# EAGLE board Arch GPRS v2.0 (EAGLE 6.4)
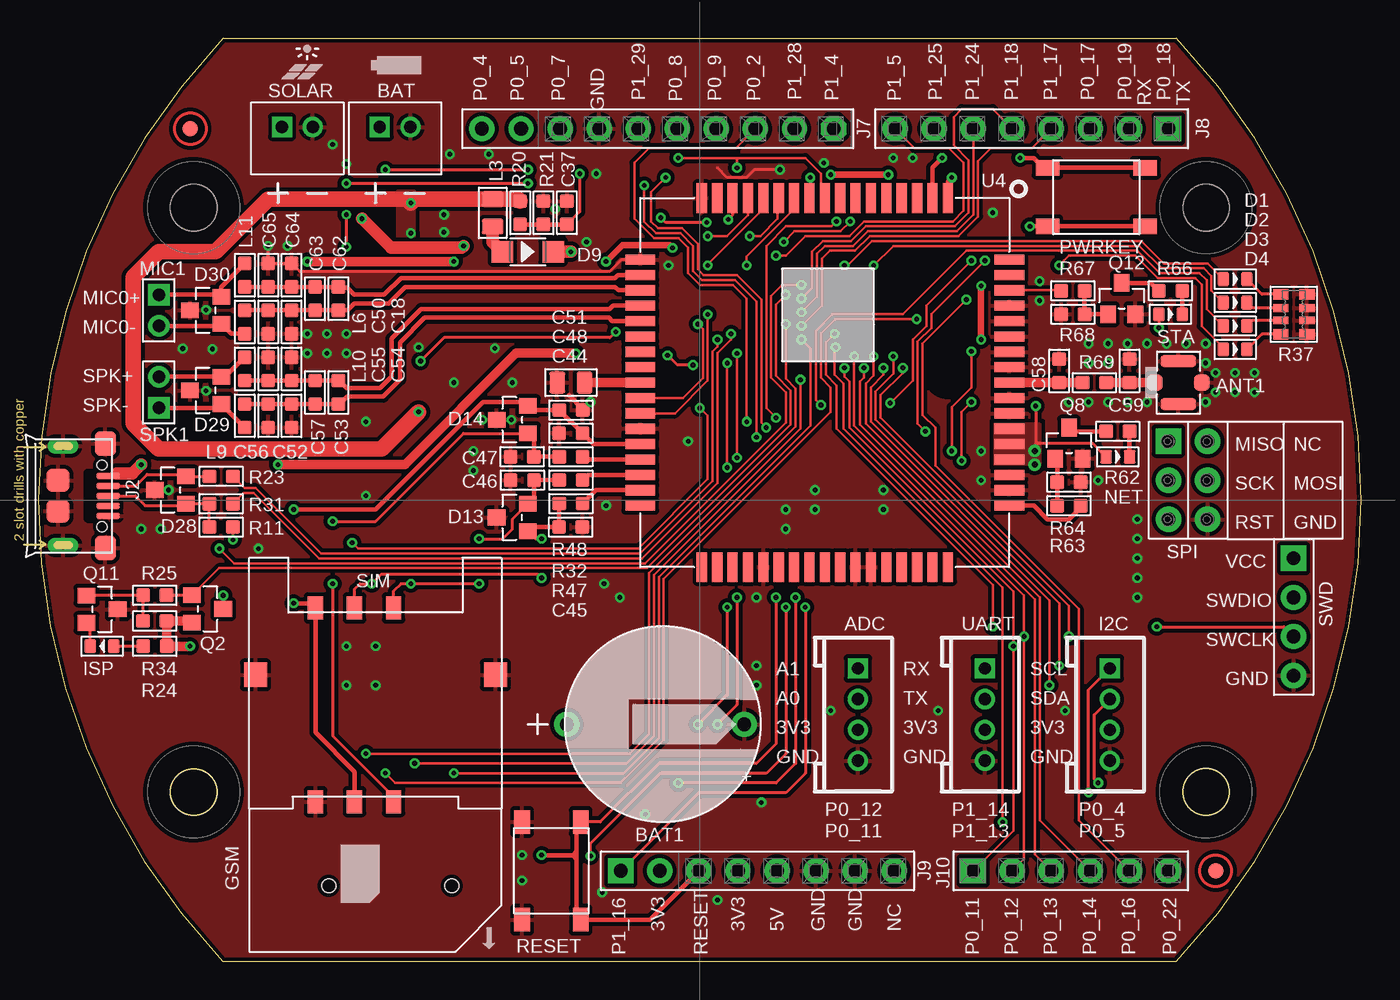
[diagram p2: board, top side]
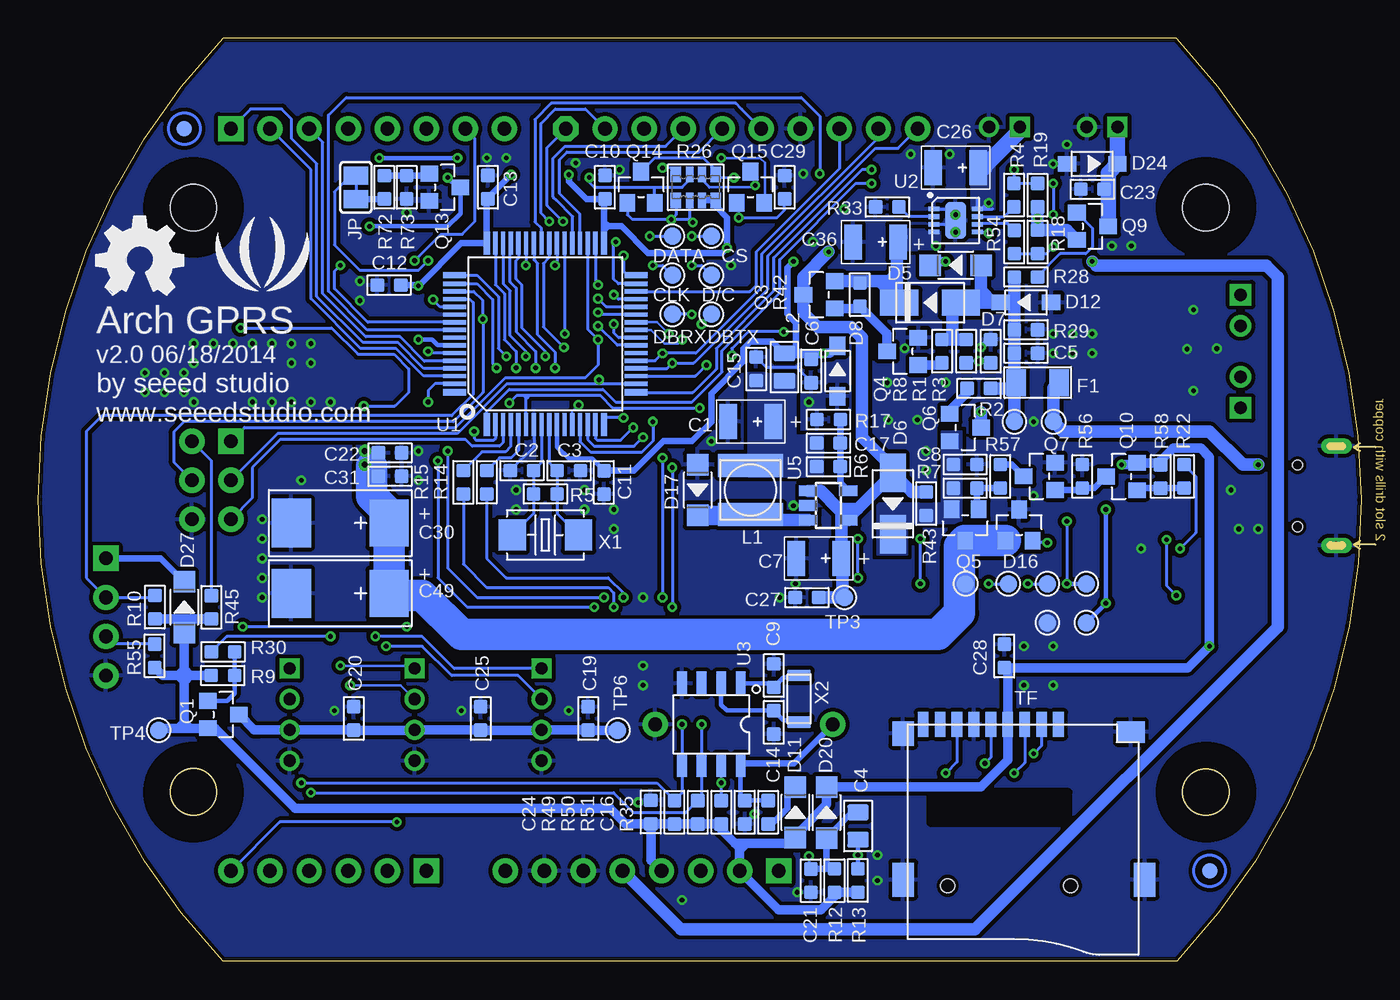
[diagram p3: board, bottom side, seen from below]

Size 86 x 60 mm. Coordinates in mm from the lower left corner, seen from the top.
Outline: 12.01,60 74,60 arc-87 74,0 11.99,0
Outline: 12.01,60 arc87 11.99,0
Outline: circle at 75.91,11 radius 1.5
Outline: circle at 10.09,11 radius 1.5
Copper layers (1*16): Top 0.035mm / dielectric 1.5mm / Bottom 0.035mm
Design rules "SeeedStudio_2layer_DRU_no_angle_20140221 *": minimum track width 6mil, minimum drill 12mil, track to track 6mil, track to pad 6mil, pad to pad 6mil, via to via 6mil, smd to smd 0mil, copper to edge 10mil, drill to drill 10mil, minimum pad ring 10mil, minimum via ring 6mil, stop-mask expansion 2mil, vias tented up to drill 100mil, thermal gap 10mil
Net classes: 0 default: width 0.102 mm, drill 0.203 mm, clearance 0.102 mm
Holes 3 mm at 10.09,49 75.91,49 75.91,11 10.09,11
tRestrict: area 72.9,46 to 78.9,52; area 72.9,8 to 78.9,14; area 7.1,8 to 13.1,14; area 7.1,46 to 13.1,52; area 62.7,42.1 to 63.6,42.2; area 62.7,41.1 to 63.6,41.2; area 62.7,40 to 63.6,40.2; area 62.7,39.1 to 63.6,39.3; area 62.7,36.1 to 63.6,36.2; area 62.7,31.1 to 63.6,31.3; area 73.5,36.9 to 74.9,38.4
bRestrict: area 7.1,46 to 13.1,52; area 72.9,46 to 78.9,52; area 7.1,8 to 13.1,14; area 72.9,8 to 78.9,14

## Footprints (pad centres in the part's own frame; a part is rotated, then mirrored left to right if it is on the bottom)
4P-2.0 = drill 0.8 pad 1.27 square: 1 -3,0 | drill 0.8 pad 1.27: 2 -1,0; 3 1,0; 4 3,0
4P-U-FL = smd 1.016 x 1.016: D -1.524,0; GND3 1.524,0 | smd 2.286 x 0.762: GND1 0,1.397; GND2 0,-1.397
JST-2.0 = drill 0.8 pad 1.3 square: 1 -1,0.75 | drill 0.8 pad 1.3: 2 1,0.75
2P-D12.55X2.22H = drill 0.889 pad 1.651: + -6.25,0; - 5.3,0
AVX-B = smd 1.143 x 2.286: + -1.46,0; - 1.46,0
C0603 = smd 0.889 x 0.889: 1 -0.762,0; 2 0.762,0
C0805 = smd 1.016 x 1.397: 1 -0.889,0; 2 0.889,0
AVX-D = smd 2.54 x 3.048: + -3.175,0 | smd 2.54 x 3.175: - 3.175,0
TP_4545 = smd 1.143 x 1.143: T 0,0
LED-0603 = smd 0.762 x 0.889: + -0.762,0; - 0.762,0
SOD123 = smd 1.397 x 1.397: + -1.651,0; - 1.651,0
SMA = smd 2.5 x 1.7: 1 2,0; 2 -2,0
SOD123-2.7X1.6 = smd 1.2 x 1.02: 1 -1.635,0; 2 1.635,0
SOT23 = smd 1.016 x 1.143: 1 -0.889,-1.016; 2 0.889,-1.016; 3 0,1.016
F1206 = smd 1.27 x 1.778: 1 -1.397,0; 2 1.397,0
MICRO-USB = smd 0.381 x 1.524: 1 -1.3,-0.25; 2 -0.65,-0.25; 3 0,-0.25; 4 0.65,-0.25; 5 1.3,-0.25 | smd 1.6 x 1.397: S1 -3.4,-0.427; S6 3.4,-0.427 | drill 0.508 pad 1.016 long: S2 -3.226,-3.175; S5 3.226,-3.175 | smd 1.5 x 1.5: S3 -1,-3.5; S4 1,-3.5 | hole 0.635: -2,-0.65; 2,-0.65
10P-2.54 = drill 0.889 pad 1.651 octagon: 1 0,11.43 | drill 0.889 pad 1.651: 2 0,8.89; 3 0,6.35; 4 0,3.81; 5 0,1.27; 6 0,-1.27; 7 0,-3.81; 8 0,-6.35; 9 0,-8.89; 10 0,-11.43
8P-2.54 = drill 0.889 pad 1.651 square: 1 0,8.89 | drill 0.889 pad 1.651: 2 0,6.35; 3 0,3.81; 4 0,1.27; 5 0,-1.27; 6 0,-3.81; 7 0,-6.35; 8 0,-8.89
6P-2.54-65/35MIL = drill 0.889 pad 1.651 square: 1 0,6.35 | drill 0.889 pad 1.651: 2 0,3.81; 3 0,1.27; 4 0,-1.27; 5 0,-3.81; 6 0,-6.35
2P-SMD-3.3X2 = smd 1.168 x 1.6: 1 -0.762,0; 2 0.762,0
L0420 = smd 1.5 x 4.2: 1 -1.6,0; 2 1.6,0
L0805 = smd 1.016 x 1.397: 1 -0.889,0; 2 0.889,0
L0603 = smd 0.889 x 0.889: 1 -0.762,0; 2 0.762,0
2P-2.0 = drill 0.813 pad 1.397 square: 1 -1.016,0 | drill 0.813 pad 1.397: 2 1.016,0
ROUND-MARK-1.0 = smd 1.016 x 1.016: P$1 0,0
BTN_S = smd 1.524 x 1.016: 0A -3.175,1.905; 0B 3.175,1.905; 1A -3.175,-1.905; 1B 3.175,-1.905
R0603 = smd 0.889 x 0.889: 1 -0.762,0; 2 0.762,0
1206-8-3.3X2.4 = smd 0.7 x 1: 1 -1.3,-0.85; 4 1.3,-0.85; 5 1.3,0.85; 8 -1.3,0.85 | smd 0.5 x 1: 2 -0.4,-0.85; 3 0.4,-0.85; 6 0.4,0.85; 7 -0.4,0.85
6P-1.8 = smd 1.5 x 1: 1 -6.3,-3.9; 2 -6.3,-1.36; 3 -6.3,1.18; 4 6.3,1.18; 5 6.3,-1.36; 6 6.3,-3.9 | smd 1.6 x 1.5: P1 -1.95,-7.8; P2 -1.95,7.8
2X3P-2.54 = drill 0.889 pad 1.651 square: 1 -1.27,2.54 | drill 0.889 pad 1.651: 2 -1.27,0; 3 -1.27,-2.54; 4 1.27,-2.54; 5 1.27,0; 6 1.27,2.54
4P-65/35MIL = drill 0.889 pad 1.651 square: 1 0,3.81 | drill 0.889 pad 1.651: 2 0,1.27; 3 0,-1.27; 4 0,-3.81
9P-SMD-W/-RING = smd 1.6 x 0.7: 1 0,2.25; 2 0,1.15; 3 0,0.05; 4 0,-1.05; 5 0,-2.15; 6 0,-3.25; 7 0,-4.35; 8 0,-5.45; 9 0,-6.55 | smd 1.6 x 1.4: G1 0.6,-7.85 | smd 2.2 x 1.4: G2 10.1,-7.85; G3 10.1,7.85 | smd 1.4 x 1.8: G4 0.5,6.95 | hole 0.9: 10.5,-4.95; 10.5,3.05
LQFP64 = smd 1.5 x 0.4: 1 -5.9,3.81; 16 -5.9,-3.81; 33 5.9,-3.81; 48 5.9,3.81 | smd 1.5 x 0.28: 2 -5.9,3.25; 3 -5.9,2.75; 4 -5.9,2.25; 5 -5.9,1.75; 6 -5.9,1.25; 7 -5.9,0.75; 8 -5.9,0.25; 9 -5.9,-0.25; 10 -5.9,-0.75; 11 -5.9,-1.25; 12 -5.9,-1.75; 13 -5.9,-2.25; 14 -5.9,-2.75; 15 -5.9,-3.25; 34 5.9,-3.25; 35 5.9,-2.75; 36 5.9,-2.25; 37 5.9,-1.75; 38 5.9,-1.25; 39 5.9,-0.75; 40 5.9,-0.25; 41 5.9,0.25; 42 5.9,0.75; 43 5.9,1.25; 44 5.9,1.75; 45 5.9,2.25; 46 5.9,2.75; 47 5.9,3.25 | smd 0.4 x 1.5: 17 -3.81,-5.9; 32 3.81,-5.9; 49 3.81,5.9; 64 -3.81,5.9 | smd 0.28 x 1.5: 18 -3.25,-5.9; 19 -2.75,-5.9; 20 -2.25,-5.9; 21 -1.75,-5.9; 22 -1.25,-5.9; 23 -0.75,-5.9; 24 -0.25,-5.9; 25 0.25,-5.9; 26 0.75,-5.9; 27 1.25,-5.9; 28 1.75,-5.9; 29 2.25,-5.9; 30 2.75,-5.9; 31 3.25,-5.9; 50 3.25,5.9; 51 2.75,5.9; 52 2.25,5.9; 53 1.75,5.9; 54 1.25,5.9; 55 0.75,5.9; 56 0.25,5.9; 57 -0.25,5.9; 58 -0.75,5.9; 59 -1.25,5.9; 60 -1.75,5.9; 61 -2.25,5.9; 62 -2.75,5.9; 63 -3.25,5.9
DFN8 = smd 0.3 x 0.727: 1 -0.75,-1.413; 2 -0.25,-1.413; 3 0.25,-1.413; 4 0.75,-1.413; 5 0.75,1.413; 6 0.25,1.413; 7 -0.25,1.413; 8 -0.75,1.413 | smd 2.413 x 1.397: HEAT 0,0
SOP8 = smd 0.635 x 1.524: 1 -1.905,-2.667; 2 -0.635,-2.667; 3 0.635,-2.667; 4 1.905,-2.667; 5 1.905,2.667; 6 0.635,2.667; 7 -0.635,2.667; 8 -1.905,2.667
SIM900 = smd 1.93 x 0.66: 1 -12,8; 2 -12,7; 3 -12,6; 4 -12,5; 5 -12,4; 6 -12,3; 7 -12,2; 8 -12,1; 9 -12,0; 10 -12,-1; 11 -12,-2; 12 -12,-3; 13 -12,-4; 14 -12,-5; 15 -12,-6; 16 -12,-7; 17 -12,-8; 35 12,-8; 36 12,-7; 37 12,-6; 38 12,-5; 39 12,-4; 40 12,-3; 41 12,-2; 42 12,-1; 43 12,0; 44 12,1; 45 12,2; 46 12,3; 47 12,4; 48 12,5; 49 12,6; 50 12,7; 51 12,8 | smd 0.66 x 1.93: 18 -8,-12; 19 -7,-12; 20 -6,-12; 21 -5,-12; 22 -4,-12; 23 -3,-12; 24 -2,-12; 25 -1,-12; 26 0,-12; 27 1,-12; 28 2,-12; 29 3,-12; 30 4,-12; 31 5,-12; 32 6,-12; 33 7,-12; 34 8,-12; 52 8,12; 53 7,12; 54 6,12; 55 5,12; 56 4,12; 57 3,12; 58 2,12; 59 1,12; 60 0,12; 61 -1,12; 62 -2,12; 63 -3,12; 64 -4,12; 65 -5,12; 66 -6,12; 67 -7,12; 68 -8,12
SOT23-5 = smd 0.69 x 1.2: 1 -0.95,-1.3; 2 0,-1.3; 3 0.95,-1.3; 4 0.95,1.3; 5 -0.95,1.3
2P-SMD-5X3.2 = smd 1.778 x 2.032: 1 -2.159,0; 2 2.159,0
2P-SMD-3.2X1.5 = smd 0.762 x 1.524: 1 -1.524,0; 2 1.524,0

## Placement (x,y rotation side)
ADC  DIP Grove  [4P-2.0]  53.29,16.03 270 top
ANT1  [4P-U-FL]  74.12,37.62 0 top
BAT  DIP JST  [JST-2.0]  23.19,53.5 0 top
BAT1  CR1220(LC)  [2P-D12.55X2.22H]  40.6,15.4 0 top
C1  10V100uF  [AVX-B]  39.69,35.08 180 bottom
C2  12pF  [C0603]  54.56,31.9 0 bottom
C3  12pF  [C0603]  51.51,31.9 180 bottom
C4  10uF  [C0805]  32.71,8.79 90 bottom
C5  100nF  [C0603]  21.79,39.53 180 bottom
C6  39pF  [C0603]  35.76,38.38 90 bottom
C7  10V100uF  [AVX-B]  35.26,26.19 180 bottom
C8  100nF  [C0603]  25.74,32.29 180 bottom
C9  DNP  [C0603]  38.19,18.57 270 bottom
C10  100nF  [C0603]  49.16,50.33 270 bottom
C11  100nF  [C0603]  49.23,31.13 90 bottom
C12  100nF  [C0603]  63.2,43.96 0 bottom
C13  100nF  [C0603]  56.77,50.33 270 bottom
C14  DNP  [C0603]  38.19,15.53 90 bottom
C15  100nF  [C0603]  39.33,38.52 270 bottom
C16  100nF  [C0603]  40.07,9.68 270 bottom
C17  39pF  [C0603]  34.63,33.68 180 bottom
C18  DNP  [C0603]  16.46,41.56 270 top
C19  100nF  [C0603]  50.26,15.78 270 bottom
C20  100nF  [C0603]  65.5,15.78 270 bottom
C21  100nF  [C0603]  35.78,5.23 90 bottom
C22  100nF  [C0603]  63.14,33.05 180 bottom
C23  100nF  [C0603]  17.46,50.19 0 bottom
C24  100nF  [C0603]  46.19,9.69 270 bottom
C25  100nF  [C0603]  57.24,15.78 270 bottom
C26  10V100uF  [AVX-B]  26.36,51.59 180 bottom
C27  100nF  [C0603]  36.03,23.65 0 bottom
C28  100nF  [C0603]  23.19,19.84 90 bottom
C29  100nF  [C0603]  37.48,50.32 90 bottom
C30  470uF 6.3V  [AVX-D]  66.38,28.49 180 bottom
C31  39pF  [C0603]  63.14,31.53 180 bottom
C36  10V100uF  [AVX-B]  31.57,46.77 180 bottom
C37  100nF  [C0603]  34.36,48.66 270 top
C44  39pF  [C0603]  34.62,34.33 0 top
C45  39pF  [C0603]  34.61,28.22 180 top
C46  39pF  [C0603]  31.46,31.27 0 top
C47  39pF  [C0603]  31.45,32.8 0 top
C48  39pF  [C0603]  34.63,35.83 180 top
C49  470uF 6.3V  [AVX-D]  66.38,23.91 180 bottom
C50  DNP  [C0603]  14.94,41.56 270 top
C51  10uF  [C0805]  34.62,37.62 0 top
C52  DNP  [C0603]  16.46,35.46 90 top
C53  DNP  [C0603]  19.51,36.99 90 top
C54  DNP  [C0603]  16.46,38.51 90 top
C55  DNP  [C0603]  14.94,38.51 90 top
C56  DNP  [C0603]  14.94,35.46 90 top
C57  DNP  [C0603]  17.99,36.99 90 top
C58  DNP  [C0603]  66.37,38.38 270 top
C59  DNP  [C0603]  70.95,38.38 270 top
C62  DNP  [C0603]  19.51,43.08 270 top
C63  DNP  [C0603]  17.99,43.08 90 top
C64  DNP  [C0603]  16.46,44.61 270 top
C65  DNP  [C0603]  14.94,44.61 270 top
CLK  [TP_4545]  44.78,44.61 180 bottom
CS  [TP_4545]  42.24,47.15 180 bottom
D1  Yellow  [LED-0603]  77.81,44.35 0 top
D2  Blue  [LED-0603]  77.81,42.83 0 top
D3  Green  [LED-0603]  77.81,41.3 0 top
D4  Red  [LED-0603]  77.81,39.78 0 top
D5  B5819W  [SOD123]  26.36,45.25 180 bottom
D6  1N5819  [SMA]  30.45,29.75 270 bottom
D7  1N5819  [SMA]  28.02,42.81 180 bottom
D8  CESD5V0D1  [SOD123-2.7X1.6]  34.04,38.38 90 bottom
D9  B5819W  [SOD123]  31.82,46.12 0 top
D11  B5819W  [SOD123]  36.78,9.68 90 bottom
D12  CESD5V0D1  [SOD123-2.7X1.6]  21.79,42.83 180 bottom
D13  DNP  [SOT23]  30.8,28.85 90 top
D14  DNP  [SOT23]  30.81,35.21 90 top
D16  CESD3V3AP  [SOT23]  22.24,28.35 0 bottom
D17  B5819W  [SOD123]  43.13,30.64 270 bottom
D20  B5819W  [SOD123]  34.75,9.67 90 bottom
D24  CESD5V0D1  [SOD123-2.7X1.6]  17.48,51.85 0 bottom
D27  B5819W  [SOD123]  76.51,23.02 90 bottom
D28  CESD3V3AP  [SOT23]  8.58,30.64 90 top
D29  DNP  [SOT23]  10.87,37.11 90 top
D30  DNP  [SOT23]  10.87,42.32 90 top
D/C  [TP_4545]  42.24,44.61 180 bottom
DATA  [TP_4545]  44.78,47.15 180 bottom
DBRX  DBURX  [TP_4545]  44.78,42.07 0 bottom
DBTX  [TP_4545]  42.24,42.07 0 bottom
F1  PPTC_1000mA  [F1206]  21.02,37.63 180 bottom
I2C  DIP Grove  [4P-2.0]  69.67,16.03 270 top
ISP  Blue  [LED-0603]  4.13,20.48 180 top
J2  [MICRO-USB]  4.78,30.26 270 top
J7  1X10P-2.54-8.5  [10P-2.54]  40.27,54.13 270 top
J8  1X8P-2.54-8.5  [8P-2.54]  64.59,54.13 270 top
J9  1X8P-2.54-8.5  [8P-2.54]  46.76,5.87 90 top
J10  1X6P-2.54-8.5  [6P-2.54-65/35MIL]  67.13,5.87 90 top
JP  [2P-SMD-3.3X2]  65.36,50.32 270 bottom
L1  4.7uH  [L0420]  39.7,30.64 90 bottom
L2  470R/2A  [L0805]  37.49,38.63 90 bottom
L3  470R/2A  [L0805]  29.54,48.66 270 top
L6  DNP  [L0603]  13.41,41.56 270 top
L9  DNP  [L0603]  13.41,35.46 270 top
L10  DNP  [L0603]  13.41,38.51 90 top
L11  DNP  [L0603]  13.41,44.61 90 top
MIC1  DNP  [2P-2.0]  7.83,42.32 270 top
NET  green  [LED-0603]  70.18,32.8 0 top
P1  [ROUND-MARK-1.0]  9.87,54.13 0 top
P2  [ROUND-MARK-1.0]  76.55,5.87 0 top
P3  [ROUND-MARK-1.0]  9.84,5.87 0 bottom
P6  [ROUND-MARK-1.0]  76.52,54.13 0 bottom
PWRKEY  DNP  [BTN_S]  68.79,49.69 180 top
Q1  CJ2305  [SOT23]  73.98,16.03 270 bottom
Q2  CJ2305  [SOT23]  11,22.9 270 top
Q3  CJ2305  [SOT23]  35.24,43.34 90 bottom
Q4  2N7002  [SOT23]  29.8,39.65 90 bottom
Q5  CJ2305  [SOT23]  25.74,28.36 180 bottom
Q6  CJ2305  [SOT23]  25.73,34.7 270 bottom
Q7  2N7002  [SOT23]  20.92,31.53 90 bottom
Q8  9013  [SOT23]  67.01,33.68 0 top
Q9  CJ2305  [SOT23]  17.46,47.78 270 bottom
Q10  CJ2305  [SOT23]  15.57,31.52 90 bottom
Q11  CJ2305  [SOT23]  4.14,22.88 270 top
Q12  9013  [SOT23]  70.44,43.08 0 top
Q13  9013  [SOT23]  59.58,50.32 270 bottom
Q14  2N7002  [SOT23]  46.82,50.32 0 bottom
Q15  2N7002  [SOT23]  39.7,50.32 0 bottom
R1  1k  [R0603]  25.67,39.66 270 bottom
R2  100R  [R0603]  24.84,37.24 0 bottom
R3  100k  [R0603]  24.08,39.66 90 bottom
R4  1k  [R0603]  22.57,49.81 270 bottom
R5  DNP  [R0603]  53.04,30.38 180 bottom
R6  68k_1%  [R0603]  34.63,32.16 180 bottom
R7  100k  [R0603]  25.74,30.76 0 bottom
R8  100R  [R0603]  27.25,39.66 90 bottom
R9  100k  [R0603]  74.01,18.57 180 bottom
R10  100k  [R0603]  78.43,23.02 90 bottom
R11  1k  [R0603]  11.87,28.22 0 top
R12  10M  [R0603]  34.24,5.24 90 bottom
R13  1k  [R0603]  32.72,5.24 90 bottom
R14  1k  [R0603]  56.85,31.14 90 bottom
R15  1k  [R0603]  58.37,31.13 90 bottom
R17  15k_1%  [R0603]  34.62,35.22 180 bottom
R18  30k  [R0603]  21.03,46.77 90 bottom
R19  30k  [R0603]  21.03,49.81 270 bottom
R20  1M_1%  [R0603]  31.32,48.66 90 top
R21  1M_1%  [R0603]  32.84,48.66 270 top
R22  100R  [R0603]  11.51,31.53 90 bottom
R23  22R  [R0603]  11.88,31.52 0 top
R24  1k  [R0603]  7.57,20.48 180 top
R25  1k  [R0603]  7.57,23.79 180 top
R26  4.7k  [1206-8-3.3X2.4]  43.26,50.32 180 bottom
R28  100R  [R0603]  21.79,44.48 180 bottom
R29  10k  [R0603]  21.79,41.06 180 bottom
R30  100R  [R0603]  74,20.1 180 bottom
R31  22R  [R0603]  11.88,29.74 0 top
R32  22R  [R0603]  34.62,31.28 0 top
R33  3.9k  [R0603]  30.8,49.05 0 bottom
R34  100k  [R0603]  7.56,22.12 180 top
R35  4.7k  [R0603]  38.55,9.68 90 bottom
R37  1k  [1206-8-3.3X2.4]  81.63,42.07 270 top
R42  1M_1%  [R0603]  32.59,43.34 270 bottom
R43  DNP  [R0603]  28.28,29.75 90 bottom
R45  DNP  [R0603]  74.76,23.01 270 bottom
R47  22R  [R0603]  34.62,29.76 0 top
R48  22R  [R0603]  34.62,32.8 0 top
R49  4.7k  [R0603]  44.65,9.68 270 bottom
R50  4.7k  [R0603]  43.12,9.68 270 bottom
R51  4.7k  [R0603]  41.6,9.68 270 bottom
R54  1k  [R0603]  22.55,46.77 90 bottom
R55  100k  [R0603]  78.44,19.85 90 bottom
R56  100k  [R0603]  18.12,31.53 270 bottom
R57  22R  [R0603]  23.46,31.53 270 bottom
R58  100k  [R0603]  13.03,31.52 90 bottom
R62  470R  [R0603]  70.18,34.45 180 top
R63  4.7k  [R0603]  67.01,29.62 180 top
R64  47k  [R0603]  67.01,31.14 0 top
R66  470R  [R0603]  73.61,43.59 180 top
R67  4.7k  [R0603]  67.26,43.59 0 top
R68  47k  [R0603]  67.26,42.07 180 top
R69  0R  [R0603]  68.66,37.62 180 top
R72  4.7k  [R0603]  63.52,50.32 90 bottom
R73  47k  [R0603]  62.06,50.32 270 bottom
RESET  BTN_S  [BTN_S]  33.35,5.87 270 top
SIM  ST-SIM-004B  [6P-1.8]  21.91,16.67 270 top
SOLAR  DIP JST  [JST-2.0]  16.84,53.5 0 top
SPI  2X3P-2.54-2.54-11.6/3.0  [2X3P-2.54]  74.75,31.27 0 top
SPK1  DNP  [2P-2.0]  7.83,36.99 90 top
STA  red  [LED-0603]  73.61,42.07 0 top
SWD  DNP  [4P-65/35MIL]  81.61,22.38 0 top
TF  [9P-SMD-W/-RING]  21.92,15.4 270 bottom
TP1  [TP_4545]  20,35.08 270 bottom
TP2  [TP_4545]  22.54,35.08 270 bottom
TP3  [TP_4545]  33.59,23.65 270 bottom
TP4  [TP_4545]  78.18,15.02 270 bottom
TP5  [TP_4545]  20.4,24.54 0 bottom
TP6  [TP_4545]  48.34,15.02 270 bottom
TP7  [TP_4545]  25.72,24.54 270 bottom
TP8  [TP_4545]  22.94,24.54 0 bottom
TP9  [TP_4545]  17.86,24.54 0 bottom
TP10  [TP_4545]  17.86,22 0 bottom
TP11  [TP_4545]  20.4,22 0 bottom
U1  LPC11U37FBD64/501  [LQFP64]  53.04,40.8 90 bottom
U2  CN3065  [DFN8]  26.36,48.16 270 bottom
U3  DS1337S  [SOP8]  42.24,15.4 180 bottom
U4  SIM900  [SIM900]  51.13,37.62 270 top
U5  TD6810-ADJ  [SOT23-5]  34.63,29.63 270 bottom
U$55  [LOGO_SILK]  71.45,45.24 0 bottom
U$56  [OSHW_FILLX200_NOTEXT]  82.25,43.34 0 bottom
UART  DIP Grove  [4P-2.0]  61.54,16.03 270 top
X1  12MHz  [2P-SMD-5X3.2]  53.04,27.71 180 bottom
X2  050037001 ABS07-32.768KHZ-7-T  [2P-SMD-3.2X1.5]  36.54,17.05 90 bottom

## Tracks (layer width: path | path; a pad name or v marks a point on that pad's centre or on a via)
DISP_CLK  (via drill 0.3 pad 0.64)
  Top 0.152: U4.11 49.13,48.83 49.07,48.83 46.05,45.81 v46.05,45.24
  Bottom 0.203: v46.05,45.24 45.42,45.24 CLK.T
DISP_CS  (via drill 0.3 pad 0.64)
  Top 0.152: U4.14 46.13,48.5 44.78,47.15 v43.51,47.15
  Bottom 0.203: v43.51,47.15 CS.T
DISP_D/C  (via drill 0.3 pad 0.64)
  Top 0.152: U4.13 47.07,49.56 47.07,48.86 43.51,45.3 v43.51,45.24
  Bottom 0.203: v43.51,45.24 42.88,45.24 D/C.T
DISP_DATA  (via drill 0.3 pad 0.64)
  Top 0.152: U4.12 48.13,48.85 48.07,48.85 48.07,48.27 46.94,47.15 v46.24,47.15 46.56,47.15
  Bottom 0.203: v46.24,47.15 DATA.T
EG10_SIM_CLK  (via drill 0.3 pad 0.64)
  Top 0.203: v28.65,27.46 30.18,27.46 30.81,28.1 30.81,28.74 D13.2 | v28.65,24.54 v24.21,24.54 23.57,24.54 23.09,24.06 SIM.3
  Top 0.305: R32.1 33.85,31.27 C46.2 32.23,30.15 D13.2
  Bottom 0.203: v28.65,24.54 v28.65,27.46 | v24.21,24.54 TP8.T
EG10_SIM_IO  (via drill 0.3 pad 0.64)
  Top 0.152: SIM.4 23.09,10.54 | D14.1 30.69,34.32
  Top 0.203: D14.1 27.64,34.32 21.92,28.6 v19.13,28.6 | v19.13,24.54 19.13,14.63 23.09,10.67 SIM.4
  Top 0.305: R48.1 C47.2 32.22,33.94 D14.1
  Bottom 0.203: v19.13,28.6 v19.13,24.54
  Bottom 0.305: TP9.T v19.13,24.54
EG10_SIM_RST  (via drill 0.3 pad 0.64)
  Top 0.203: v32.72,27.46 32.32,27.46 D13.1 | 32.66,24.98 v32.72,24.92 32.46,25.18 22.3,25.18 v21.67,24.54 20.91,24.54 20.55,24.19 SIM.2 | 33.86,28.37 33.86,28.24 C45.2
  Top 0.305: C45.2 32.08,28.22 D13.1 | R47.1 33.86,28.37
  Bottom 0.203: v32.72,24.92 v32.72,27.46 | v21.67,24.54 TP5.T
GND  (via drill 0.3 pad 0.64)
  Top 0.203: v48.21,51.46 46.56,51.46 46.05,50.96 44.78,50.96 44.15,51.59 | v14.94,46.51 C65.1 C64.1 16.97,44.86 37.16,44.86 37.92,45.62 U4.18
  Top 0.254: C56.1 14.94,34.64
  Top 0.305: C48.1 35.39,35.9 34.5,36.8 | U4.18 38.43,45.62
  Bottom 0.203: U1.7 53.79,33.44 C2.1 | U2.1 26.51,48.91 | U2.3 26.5,47.91 26.36,48.05 U2.HEAT | C15.1 38.69,38.64 36.72,38.64 35.76,37.68 C6.1
  Bottom 0.305: C16.2 40.07,8.93 v39.45,9.55
  Bottom 0.406: v24.72,39.91 24.2,40.43 R3.2 24.17,40.43 24.72,39.88 v24.72,39.91 | v24.72,39.91 24.74,39.88
  other vias: 20.02,51.85 17.48,39.53 17.48,40.8 20.02,40.8 20.02,39.53 21.29,30.26 27,37.62 29.67,39.84 21.29,35.08 18.75,39.53 18.75,40.8 20.02,20.48 21.92,20.48 21.92,17.94 20.02,17.94 8.46,30.64 6.68,28.1 7.95,28.1 36.66,4.47 31.45,5.24 31.45,6.89 44.15,3.97 47.01,10.32 65.1,42.96 61.29,31.27 61.29,33.18 54.94,30.64 54.94,29.37 50.5,30.64 50.5,29.37 48.59,29.37 48.59,28.1 46.69,23.65 46.69,19.21 46.69,17.94 62.06,48.67 56.85,52.23 55.58,52.23 40.97,45.24 36.27,51.21 26.37,48.54 26.37,47.4 28.27,31.91 28.27,33.18 28.84,35.21 30.75,35.21 30.81,37.62 35.89,36.35 42.24,33.81 37.8,23.65 36.78,24.54 36.91,29.62 51.07,51.91 68.28,38.89 69.55,38.89 69.55,40.16 68.28,40.16 68.28,36.35 69.55,36.35 70.82,36.35 72.09,36.35 67.01,36.35 70.82,40.16 72.09,40.16 73.36,40.16 74.63,40.16 75.9,40.16 76.53,38.26 76.53,36.99 75.9,36.35 75.9,38.89 77.8,36.99 77.8,38.26 79.07,36.99 79.07,38.26 68.91,31.27 71.45,28.73 71.45,27.46 71.45,26.19 71.45,24.92 71.45,23.65 65.1,44.23 14.3,26.83 10.9,42.35 10.9,37.09 9.38,39.83 11.31,39.81 16.21,46.51 58.5,16.29 66.75,16.29 51.51,16.29 26.75,52.48 29.29,52.48 33.61,48.92 35.64,46.77 19.13,53.12
  pour Top (isolate 0.254, rank 6): -0.94,60.48 86.69,60.48 86.69,-0.48 -0.94,-0.48
  pour Bottom (isolate 0.254, rank 6): -0.94,60.48 86.69,60.48 86.69,-0.48 -0.94,-0.48
LDBG_RX  (via drill 0.3 pad 0.64)
  Top 0.152: U4.28 41.38,35.62 43.51,37.75 v43.51,42.07
  Bottom 0.203: v43.51,42.07 DBRX.T
LDBG_TX  (via drill 0.3 pad 0.64)
  Top 0.152: U4.27 41.9,36.62 43.2,37.92 43.2,41.11 v42.88,41.43
  Bottom 0.203: v42.88,41.43 DBTX.T
LRXD  (via drill 0.3 pad 0.64)
  Top 0.152: v50.18,50.96 50.18,50.26 50.24,50.19 50.24,49.73 U4.10
  Bottom 0.203: R26.3 43.66,50.81 44.15,50.32 45.93,50.32 | v50.18,50.96 50.18,50.64 49.86,50.32 45.93,50.32 | Q14.2 45.93,50.32
LTXD  (via drill 0.3 pad 0.64)
  Top 0.152: v41.61,52.23 45.29,52.23 | v45.42,51.59 45.42,52.1 | 45.42,52.1 45.42,52.23 | 45.42,52.23 45.55,52.23 | 45.55,52.23 49.86,52.23 50.88,51.21 50.88,49.88 U4.9 | 45.29,52.23 45.42,52.1 | 45.42,52.1 45.55,52.23 | 45.42,52.23 45.29,52.23
  Bottom 0.152: v41.61,52.23 39.07,52.23 38.75,51.91 38.75,49.37 Q15.2 38.43,49.69 | 44.53,51.46 44.56,51.43 R26.4 44.98,51.59 | v45.42,51.59 44.98,51.59 | 44.98,51.59 44.66,51.59
  Bottom 0.203: 44.73,51.34 R26.4
N$1
  Bottom 0.406: SWD.1 78.04,26.19 D27.-
N$2
  Top 0.203: R37.4 79.56,40.77 D4.-
N$3  (via drill 0.3 pad 0.64)
  Top 0.203: v12.02,23.78 Q2.3 | v12.65,27.4 12.65,28.21 R11.2
  Bottom 0.203: v12.65,27.4 12.65,24.41 v12.02,23.78
N$4
  Bottom 0.406: R57.2 R7.2 24.98,29.62 24.85,29.49 Q5.1
N$5
  Bottom 0.203: U2.2 29.41,48.41 R33.2
N$6
  Bottom 0.406: R35.1 38.31,8.91 37.29,9.94 37.29,11.08 37.04,11.33 D11.-
N$7  (via drill 0.3 pad 0.64)
  Top 0.203: v48.59,23.02 48.59,13.49 47.32,12.22 40.47,12.22 35.89,7.65 v35.89,6.82
  Bottom 0.203: R15.1 58.37,25.81 56.85,24.29 48.94,24.29 48.59,23.94 v48.59,23.02 | 36.02,6.24 C21.2 35.89,6.11 v35.89,6.82
  Bottom 0.406: C21.2 34.75,5.99 | 34.75,5.99 R12.2 | C4.2 33.09,9.68 D20.+ 34.75,5.99
N$8
  Bottom 0.61: 32.47,42.46 R42.2 | Q3.1 32.71,42.45 R42.2 | Q4.3 30.82,40.8 R42.2
N$9
  pour Bottom (isolate 0.254, no thermals): 25.99,34.45 27.26,34.45 27.26,29.75 31.45,29.75 31.45,26.45 29.54,26.45 29.54,28.48 25.99,28.48
N$10
  Top 0.813: L3.2 29.54,46.75 D9.+
N$11
  Bottom 0.406: JP.2 R72.1
N$12
  Bottom 0.305: R30.1 R9.1 73.25,17.41 73.74,16.92 Q1.1
N$13
  Bottom 0.305: U3.2 41.61,16.67 41.23,16.29 C14.2 37.55,15.65 36.53,15.65 36.54,15.64 X2.1
N$14
  Bottom 0.305: U3.1 38.45,18.06 C9.2 37.55,18.44 36.53,18.44 36.54,18.45 X2.2
N$15
  Top 0.203: R34.2 R25.2 3.14,23.79 Q11.1
N$16
  Top 0.203: ISP.- 3.37,21.74 Q11.2
N$17
  Top 0.203: R37.3 78.94,41.67 D3.-
N$18
  Top 0.203: R24.2 ISP.+
N$19
  Top 0.203: R37.2 78.94,42.47 D2.-
N$20
  Top 0.305: L6.1 C50.1 C18.1 C63.1 C62.2 20.09,42.32 20.53,42.75 22.76,42.75 23.85,43.84 37.49,43.84 37.72,43.62 U4.20
N$23
  Bottom 0.203: SPI.6 74.76,32.54 R45.1
N$24
  Bottom 0.305: R35.2 C16.1 | 40.35,10.72 C16.1 | U3.8 40.34,10.7 C16.1
  Bottom 0.406: 40.35,12.71 40.35,12.84 40.34,12.86 36.89,12.86 BAT1.+ | 40.35,12.36 40.35,12.71 | 40.35,12.71 U3.8
N$25
  Top 0.305: MIC1.2 11.76,41.3 D30.1 | D30.1 12.14,41.43 | L6.2 12.53,40.8 D30.1
N$26
  Top 0.305: MIC1.1 11.76,43.34 D30.2 11.89,43.84 L11.2
N$27
  Bottom 0.61: 26.87,35.46 Q6.1 26.75,35.85 25.61,36.99 R2.1
N$28
  Top 0.203: R37.1 79.56,43.37 D1.-
N$29
  Bottom 0.813: U5.3 39.34,28.68 L1.1
  Bottom 1.27: D17.- 39.75,28.99 L1.1
N$30
  Top 0.305: SPK1.1 11.64,35.97 D29.1 L9.2
N$33
  Bottom 0.203: Q9.1 17.47,47.66 17.47,46.44 17.9,46 19.57,46 21.02,44.55 R28.1
N$35
  Top 0.203: J2.2 6.32,30.91 7.06,31.65 9.47,31.65 D28.2 R23.1
N$36
  Top 0.203: J2.3 6.3,30.26 6.94,29.62 9.47,29.62 D28.1 R31.1 R11.1
N$37  (via drill 0.3 pad 0.64)
  Top 0.813: v21.03,48.29 22.94,46.38 27.51,46.38 v27.64,46.51
  Bottom 0.406: Q9.2 18.48,47.03 18.37,47.15 | C36.+ 30.11,46.83 30.05,46.89
  Bottom 0.61: 29.79,47.15 29.79,47.02 30.05,46.77
  Bottom 0.813: 31.32,44.23 Q3.2 32.71,44.23 R42.1 | 31.32,44.23 30.69,44.23 | 30.69,44.23 30.18,44.23 30.18,43.59 30.17,43.59 | 30.17,43.59 30.17,43.19 | 30.17,43.19 30.17,42.97 D7.1 | 30.17,43.59 30.17,46.7 C36.+ | 30.69,44.23 30.18,44.73 | 30.17,43.19 30.29,43.19 31.32,44.23 | R19.2 v21.03,48.29 R18.2 19.12,47.53 Q9.2
  pour Bottom (isolate 0.254, no thermals): 27.38,47.53 30.56,47.53 30.56,46.26 27.38,46.26
N$38  (via drill 0.3 pad 0.64)
  Top 0.152: 4.81,31.56 5.06,31.56 5.16,31.65 5.1,31.72 5.03,31.78
  Top 0.305: J2.1 4.81,31.56 5.25,31.56 5.41,31.72
  Top 0.813: 5.1,31.72 5.41,31.72 6.11,31.72 v6.68,32.29
  Bottom 0.813: 19.37,34.45 9.86,34.45 7.7,32.29 v6.68,32.29 | 19.37,34.45 TP1.T 20,37.25 F1.1 | 19.37,34.45 19.38,34.45 19.63,34.69
N$39
  Bottom 0.406: R17.1 33.87,35.21 C17.1 R6.1 33.87,31.11 U5.5
N$40
  Bottom 0.61: Q4.1 27.39,38.76 R8.1
N$43
  Bottom 0.203: U2.7 23.21,48.41 R4.2
N$44
  Bottom 0.203: R54.2 22.93,47.91 22.94,47.91 23,47.97 24.89,47.97 U2.6
N$45
  Bottom 0.406: R57.1 22.7,32.29 Q7.3
N$46
  Bottom 0.406: Q7.1 18.25,30.64 R56.2 17.34,30.76 Q10.3
N$47
  pour Bottom (isolate 0.254, no thermals): 36.78,38.26 39.83,38.26 39.83,31.53 35,31.53 35,34.19 36.78,34.19
N$48
  Bottom 0.406: R22.1 13.02,30.76 R58.1 14.43,30.75 Q10.1
N$49
  Top 0.305: R62.2 67.26,34.45 Q8.3
N$50
  Top 0.305: R62.1 NET.-
N$51
  Top 0.305: R63.2 R64.1 66.25,32.54 Q8.1
N$52
  Top 0.305: R63.1 67.77,29.49 67.01,28.73 65.61,28.73 64.72,29.62 U4.52
N$53
  Top 0.305: U4.21 37.35,42.62 37.13,42.4 24.87,42.4 22.96,40.49 22.96,38.03 22.2,37.27 20.04,37.27 19.56,37.75 C53.2 | C53.2 19.76,37.75 | L10.1 C55.1 C54.1 C57.2 C53.2
N$54
  Top 0.305: 19.76,36.48 C53.1 | U4.22 37.3,41.62 37.09,41.84 25.12,41.84 23.51,40.22 23.51,37.81 22.41,36.71 20.07,36.71 19.59,36.22 C53.1 | C53.1 19.54,36.22 | L9.1 C56.2 C52.2 C57.1 C53.1
N$55
  Top 0.305: Q12.3 72.34,44.1 R66.2
N$56
  Top 0.305: STA.- R66.1
N$57
  Top 0.305: Q12.1 R68.1 R67.2
N$58
  Top 0.152: U4.66 66.47,43.62
  Top 0.305: 66.47,43.62 R67.1
N$59
  Top 0.61: R69.2 C58.2 U4.60
N$60
  Top 0.61: R69.1 C59.2 ANT1.D
N$61
  Top 0.305: L11.1 C65.2 C64.2 C63.2 C62.1 19.56,43.79 20.07,43.79 20.53,43.34 22.48,43.34 23.57,44.43 37.51,44.43 37.7,44.62 U4.19
N$63
  Bottom 0.203: Q13.1 60.6,51.15 60.66,51.08
  Bottom 0.406: R72.2 R73.1 60.66,51.08 60.4,51.08
N$64  (via drill 0.3 pad 0.64)
  Top 0.305: U4.2 58.13,51.61 v58.75,52.23 | v63.83,52.23 64.72,52.23 65.36,51.59 PWRKEY.1B PWRKEY.1A
  Bottom 0.305: v58.75,52.23 v63.83,52.23
N$92
  Top 0.305: SPK1.2 D29.2 12.14,38 L10.2
PIO0_0/RES
  Bottom 0.203: U1.4 55.29,33.47 55.64,33.11 57.16,33.11 R15.2
PIO0_1
  Bottom 0.203: U1.5 54.79,33.2 55.26,32.73 56.02,32.73 R14.2
PIO0_2/SSEL0  (via drill 0.3 pad 0.64)
  Top 0.152: J7.3 45.35,52.86 39.7,52.86 38.75,51.91 38.75,48.29 40.02,47.02 41.61,47.02 42.24,46.38 42.24,44.73 43.01,43.97 45.16,43.97 46.05,43.08 v46.05,35.08
  Bottom 0.203: 50.79,35.43 U1.13 50.79,33.78 50.12,33.11 46.75,33.11 46.05,33.81 v46.05,35.08
PIO0_3/VBUS  (via drill 0.3 pad 0.64)
  Top 0.203: v42.56,38.76 41.54,38.76 v40.91,39.4 | v37.54,40.92 37.16,40.54 26.37,40.54 v24.84,39.02
  Bottom 0.203: v37.54,40.92 39.83,40.92 40.91,39.84 v40.91,39.4 | R1.2 25.55,39.02 v24.84,39.02 24.2,39.02 R3.1 | U1.19 43.28,38.05 v42.56,38.76
  Bottom 0.406: R1.2 25.67,38.96 25.61,39.02
PIO0_4/SCL  (via drill 0.3 pad 0.64)
  Top 0.152: v44.78,38.89 v44.78,32.1
  Top 0.203: v44.78,23.02 44.78,17.3 v42.88,15.4 | v68.28,10.95 68.28,17.64 I2C.1
  Bottom 0.203: 42.89,10.67 R50.1 | U1.20 45.13,38.55 v44.78,38.89 43.39,38.89 38.56,43.72 38.56,45.88 31.58,52.86 30.11,52.86 J7.10 | R50.1 42.88,10.68 U3.6 v42.88,15.4 | v44.78,32.1 v44.78,23.02 | v68.28,10.95 48.59,10.95 47.32,9.68 43.88,9.68 R50.1
  Bottom 0.406: 42.89,12.36 42.89,12.71 U3.6
PIO0_5/SDA  (via drill 0.3 pad 0.64)
  Top 0.152: v45.42,39.53 v45.42,32.73
  Top 0.203: v45.42,23.65 45.42,16.67 v44.15,15.4 | v68.91,11.59 68.66,11.84 68.66,16.02 I2C.2
  Bottom 0.203: J7.9 31.38,53.56 38.94,46 38.94,43.84 43.26,39.53 v45.42,39.53 45.9,39.05 U1.21 | v45.42,32.73 v45.42,23.65 | v68.91,11.59 45.8,11.59 R49.1 44.15,10.94 44.15,12.22 U3.5 v44.15,15.4
  Bottom 0.406: 44.16,12.36 44.16,12.24 44.15,12.22
PIO0_6  (via drill 0.3 pad 0.64)
  Top 0.152: 9.99,24.16 9.99,24.03 9.98,24.03 Q2.1 11.75,25.56 39.58,25.56 48.91,34.89 48.91,37.11 47.96,38.07 47.96,42.7 v48.59,43.34
  Top 0.203: Q2.1 R25.1
  Bottom 0.203: U1.29 48.3,43.05 v48.59,43.34
PIO0_7
  Bottom 0.203: J7.8 33.92,51.53 39.32,46.13 39.32,43.97 39.75,43.55 U1.30
PIO0_8/MISO0
  Bottom 0.203: 51.89,49.68 50.79,48.58 U1.36 | 51.89,49.68 | J7.5 43.06,52.61 51.64,52.61 52.15,52.1 52.15,49.94 51.89,49.68
PIO0_9/MOSI0
  Bottom 0.203: 52.33,49.48 51.26,48.42 51.26,46.72 U1.37 | J7.4 45.22,52.99 51.77,52.99 52.53,52.23 52.53,49.69 52.33,49.48 | 52.33,49.48 | 52.33,49.48
PIO0_10/SWCLK  (via drill 0.3 pad 0.64)
  Top 0.152: v62.06,21.75 62.06,24.48 51.9,34.64 51.9,37.43 51.2,38.13 51.2,40.22 v51.77,40.8
  Top 0.203: v72.72,21.75 80.98,21.75 SWD.3
  Bottom 0.203: U1.38 51.79,40.82 v51.77,40.8 | R55.2 81.12,20.61 SWD.3 | v62.06,21.75 v72.72,21.75
PIO0_11  (via drill 0.3 pad 0.64)
  Top 0.152: J10.1 63.39,8.48 v63.39,20.48 63.39,24.03 52.72,34.7 52.72,37.68 52.4,38 v52.4,38.57
  Bottom 0.203: v52.4,38.57 52.4,39.59 53.55,40.73 53.55,45.37 53.79,45.61 U1.42 | ADC.2 53.29,17.04 54.82,18.57 59.13,18.57 61.04,20.48 v63.39,20.48
PIO0_12  (via drill 0.3 pad 0.64)
  Top 0.152: J10.2 64.09,6.64 v64.09,21.11 64.09,23.78 53.04,34.83 v53.04,39.34
  Bottom 0.203: v53.04,39.34 53.04,39.65 54.56,41.18 54.56,43.97 54.94,44.35 54.94,45.56 54.79,45.71 U1.44 | ADC.1 58.96,19.03 61.04,21.11 v64.09,21.11
PIO0_13  (via drill 0.3 pad 0.64)
  Top 0.152: J10.3 64.79,6.95 64.79,23.52 53.42,34.89 53.42,37.68 53.67,37.94 v53.67,38.57
  Bottom 0.203: v53.67,38.57 53.67,39.65 54.94,40.92 54.94,43.78 55.32,44.16 55.32,46.66 U1.45
PIO0_14  (via drill 0.3 pad 0.64)
  Top 0.152: J10.4 65.1,9.17 65.1,23.65 53.8,34.95 53.8,37.56 54.31,38.07 v54.31,39.34
  Bottom 0.203: U1.46 55.79,44.05 55.32,43.59 55.32,40.67 54.31,39.65 v54.31,39.34
PIO0_15/SWDIO
  Bottom 0.203: R10.2 78.56,23.65 SWD.2 82.88,24.92 82.88,34.45 81.87,35.46 59.13,35.46 57.74,36.86 57.74,42.83 57.96,43.05 U1.52
PIO0_16  (via drill 0.3 pad 0.64)
  Top 0.152: J10.5 67.64,9.17 67.64,22.89 58.31,32.22 58.31,34.7 57.48,35.53 57.48,40.16 v60.34,43.02
  Bottom 0.203: U1.53 59.87,42.55 v60.34,43.02
PIO0_17/D2
  Bottom 0.203: J8.3 67.52,53.25 67.52,43.4 64.72,40.61 62.5,40.61 60.91,39.02 58.97,39.02 U1.60
PIO0_18/RX
  Bottom 0.203: J8.1 72.21,55.4 70.18,55.4 69.55,54.77 69.55,53.5 67.9,51.85 67.9,43.23 64.9,40.22 62.63,40.22 60.95,38.55 U1.61
PIO0_19/TX
  Bottom 0.203: J8.2 68.28,51.47 68.28,43.07 65.05,39.84 62.75,39.84 60.96,38.05 U1.62
PIO0_22  (via drill 0.3 pad 0.64)
  Top 0.152: v62.69,9.05 62.69,24.29 52.34,34.64 52.34,37.56 51.77,38.13 51.77,39.84 v51.83,39.91
  Bottom 0.203: U1.40 52.79,45.75 52.78,45.75 53.17,45.37 53.17,41.24 v51.83,39.91 | v62.69,9.05 70.31,9.05 J10.6
PIO0_23  (via drill 0.3 pad 0.64)
  Top 0.203: v35.2,51.21 35.2,48.74 C37.2
  Top 0.305: R20.1 R21.2 C37.2
  Bottom 0.203: U1.56 64.63,41.05 67.14,43.56 67.14,55.02 65.99,56.16 36.4,56.16 35.2,54.96 v35.2,51.21
PIO1_0  (via drill 0.3, 0.3 pad 0.64)
  Top 0.203: v20.02,50.58 v31.83,50.58 | v20.02,48.54 v20.02,46.45
  Bottom 0.203: U1.1 56.85,35.72 55.39,37.18 49.29,37.18 48.47,36.35 43.51,36.35 41.54,38.32 41.54,39.72 37.8,43.46 37.8,45.62 32.85,50.58 v31.83,50.58 | 22.68,45.88 R54.1 R18.1 | 20.9,45.88 R18.1 | 20.85,46.19 R18.1 | R18.1 | R18.1 20.46,46 v20.02,46.45 | v20.02,50.58 v20.02,48.54
PIO1_1  (via drill 0.3 pad 0.64)
  Top 0.203: v22.56,51.46 v31.83,51.46
  Bottom 0.203: R19.1 R4.1 22.56,50.59 v22.56,51.46 | U1.17 43.45,36.99 41.93,38.51 41.93,39.84 38.18,43.59 38.18,45.75 32.46,51.46 v31.83,51.46
PIO1_2  (via drill 0.3 pad 0.64)
  Top 0.152: v49.61,43.97 48.36,43.97 47.63,43.24 47.63,37.95 48.59,36.99 48.59,35.02 39.45,25.87 12.72,25.87 v11.76,26.83
  Bottom 0.152: R22.2
  Bottom 0.203: U1.34 49.79,44.15 v49.61,43.97 | R22.2 10.75,31.53 10.75,27.84 v11.76,26.83
PIO1_3  (via drill 0.3 pad 0.64)
  Top 0.152: v56.21,38.57 56.21,38.26 54.75,36.8 54.75,35.34 67.01,23.08 v67.01,21.11
  Bottom 0.152: R30.2 74.75,20.11
  Bottom 0.203: U1.50 57.49,44.05 56.47,43.02 56.47,38.83 v56.21,38.57 | v67.01,21.11 73.75,21.11 R30.2
PIO1_4/D8  (via drill 0.3 pad 0.64)
  Top 0.152: v51.9,48.1 51.58,47.78 48.59,47.78 47.32,46.51 47.32,35.97 v47.96,35.34
  Bottom 0.203: 51.9,53.94 J7.1 52.93,52.91 52.93,49.13 v51.9,48.1 | v47.96,35.34 49.1,35.34 49.23,35.46 U1.16
PIO1_5/D7  (via drill 0.3 pad 0.64)
  Top 0.152: J8.8 56.97,52.86 59.21,52.86 60.15,51.92 60.15,48.8 59.45,48.1 53.67,48.1 52.72,47.15 49.86,47.15 48.59,45.88 v47.96,45.88
  Bottom 0.203: 47.58,44.61 U1.32 47.7,44.61 47.96,44.86 v47.96,45.88
PIO1_7  (via drill 0.3 pad 0.64)
  Top 0.152: v43.01,35.97 43.51,35.46 43.51,31.34 39,26.83 20.78,26.83 v20.4,27.21 | v60.66,45.56 57.74,42.64 57.74,41.3 56.85,40.42 56.85,37.75 v55.39,36.29
  Bottom 0.203: v55.39,36.29 54.88,36.8 54.5,36.8 | 54.5,36.8 54.31,36.8 | 54.31,36.8 54.05,36.8 | 54.05,36.8 49.48,36.8 48.66,35.97 v43.01,35.97 | U1.6 54.29,36.78 54.31,36.8 | v60.66,45.56 61.29,44.92 65.1,44.92 66.75,46.57 66.75,50.03 65.7,51.08 JP.1 65.36,49.56 | 21.09,27.08 D16.2 21.22,27.21 v20.4,27.21 | 54.5,36.8 54.31,36.61 54.24,36.61 54.05,36.8
PIO1_8  (via drill 0.3 pad 0.64)
  Top 0.152: v52.4,45.24 52.59,45.24 54.18,46.83 71.71,46.83 73.17,45.37 76.04,45.37 D1.+
  Bottom 0.203: U1.39 52.29,45.36 v52.4,45.24
PIO1_9  (via drill 0.3 pad 0.64)
  Top 0.152: 66.69,45.56 v66.37,45.24 67.01,45.88 71.33,45.88 72.79,44.42 75.22,44.42 75.64,43.99 75.64,41.3 77.05,39.9 D4.+
  Bottom 0.203: U1.55 64.58,41.55 66.75,43.72 66.75,44.86 v66.37,45.24
PIO1_10  (via drill 0.3 pad 0.64)
  Top 0.152: D3.+ 75.96,42.39 75.96,44.27 75.5,44.73 72.91,44.73 71.45,46.19 60.35,46.19 56.22,42.07 51.64,42.07 50.56,40.99 50.56,36.48 v50.88,36.16
  Bottom 0.152: U1.12 51.29,35.75 v50.88,36.16
PIO1_11  (via drill 0.3 pad 0.64)
  Top 0.152: D2.+ 76.28,43.6 76.28,44.56 75.78,45.05 73.04,45.05 71.58,46.51 55.58,46.51 v54.31,45.24
  Bottom 0.203: U1.43 54.29,45.26 v54.31,45.24
PIO1_12  (via drill 0.3 pad 0.64)
  Top 0.152: v60.66,39.65 60.66,37.3 59.39,36.03 v59.39,33.18
  Top 0.203: v49.23,23.65 49.23,12.86 47.96,11.59 v41.61,11.59
  Bottom 0.152: 41.61,12.74 U3.7
  Bottom 0.203: U1.59 60.55,39.55 v60.66,39.65 | 41.61,12.74 v41.61,11.59 R51.1 | v59.39,33.18 59.39,25.56 57.48,23.65 v49.23,23.65
PIO1_13/TX  (via drill 0.3 pad 0.64)
  Top 0.152: v65.74,17.94 65.74,23.46 54.12,35.08 54.12,37.3 54.94,38.13 v54.94,38.57
  Bottom 0.152: 61.81,17.3 UART.2 62.45,17.94 v65.74,17.94
  Bottom 0.203: 56.29,46.52 56.28,46.51 | U1.47 56.29,46.52 | 56.29,46.52 56.29,43.98 55.71,43.4 55.71,40.42 54.94,39.65 v54.94,38.57
PIO1_14/RX  (via drill 0.3 pad 0.64)
  Top 0.152: v66.37,19.21 66.37,23.27 54.44,35.21 54.44,37.05 55.58,38.19 v55.58,39.34
  Bottom 0.152: v66.37,19.21 61.72,19.21 UART.1
  Bottom 0.203: U1.49 57.48,44.61 56.09,43.21 56.09,39.84 v55.58,39.34
PIO1_16  (via drill 0.3 pad 0.64)
  Top 0.152: v60.02,32.54 60.02,35.72 v60.66,36.35
  Top 0.203: v49.86,23.02 49.86,12.22 48.59,10.95 42.95,10.95 J9.1
  Bottom 0.203: v60.02,32.54 60.02,24.92 58.12,23.02 v49.86,23.02 | U1.63 60.23,37.55 60.66,37.11 v60.66,36.35
PIO1_17/D3  (via drill 0.3 pad 0.64)
  Top 0.152: J8.4 64.59,52.86 61.93,52.86 61.1,52.04 61.1,48.42 59.83,47.15 54.05,47.15 53.1,46.19 51.45,46.19 50.94,45.69 50.94,42.64 v49.61,41.3
  Bottom 0.203: U1.23 48.35,40.05 v49.61,41.3
PIO1_18/D4  (via drill 0.3 pad 0.64)
  Top 0.152: J8.5 62.05,55.4 60.02,55.4 59.52,54.89 59.52,53.05 60.47,52.1 60.47,48.67 59.58,47.78 53.8,47.78 52.85,46.83 51.01,46.83 50.31,46.13 50.31,43.78 v49.61,43.08
  Bottom 0.203: U1.28 49.07,42.55 v49.61,43.08
PIO1_19/SSEL1
  Bottom 0.203: SPI.3 72.09,30.12 72.09,32.1 70.25,33.94 58.25,33.94 57.8,33.49 56.02,33.49 55.79,33.73 U1.3
PIO1_20/SCK1  (via drill 0.3 pad 0.64)
  Top 0.152: v49.55,37.81 49.55,34.64 40.02,25.11 40.02,14.63 38.24,12.86 v24.46,12.86
  Bottom 0.203: SPI.2 70.43,34.32 58.75,34.32 55.53,37.55 49.61,37.55 | 49.61,37.55 U1.18 | v49.55,37.81 49.55,37.61 49.61,37.55 | TF.5 24.07,13.25 v24.46,12.86
PIO1_21/MISO1  (via drill 0.3 pad 0.64)
  Top 0.152: v49.61,40.42 50.19,39.84 50.19,34.84 40.34,24.98 40.34,14.51 38.05,12.22 v27,12.22
  Bottom 0.203: SPI.1 72.59,34.7 58.88,34.7 55.64,37.94 50.43,37.94 49.61,38.76 v49.61,40.42 50.29,41.09 U1.35 | TF.7 26.27,12.95 v27,12.22
PIO1_22/MOSI1  (via drill 0.3 pad 0.64)
  Top 0.152: v57.1,41.75 51.83,41.75 50.88,40.8 50.88,37.94 51.5,37.31 51.5,35.71 40.66,24.86 40.66,14.38 37.86,11.59 23.19,11.59 v22.56,12.22
  Bottom 0.203: SPI.5 77.17,32.41 77.17,34.45 76.53,35.08 59.01,35.08 57.1,36.99 v57.1,41.75 57.1,42.96 57.69,43.55 U1.51 | TF.3 21.87,12.91 v22.56,12.22
PIO1_23/SSEL1  (via drill 0.3 pad 0.64)
  Top 0.152: v48.59,41.43 48.59,37.88 49.22,37.25 49.22,34.76 39.7,25.24 39.7,14.76 38.43,13.49 v21.29,13.49
  Bottom 0.203: v48.59,41.43 48.59,40.86 48.28,40.55 U1.24 | TF.2 20.77,14.01 v21.29,13.49
PIO1_24/D5  (via drill 0.3 pad 0.64)
  Top 0.152: J8.6 60.78,48.54 59.71,47.46 53.93,47.46 52.97,46.51 51.13,46.51 50.63,46 50.63,43.21 v49.61,42.19
  Bottom 0.203: U1.27 49.46,42.05 v49.61,42.19
PIO1_25/D6  (via drill 0.3 pad 0.64)
  Top 0.152: v61.55,45.56 58.06,42.07 58.06,41.18 57.17,40.29 57.17,34.95 v57.67,34.45
  Bottom 0.203: v57.67,34.45 57.67,34 57.55,33.87 56.4,33.87 56.29,33.99 U1.2 | J8.7 57.61,53.5 57.61,48.11 58.45,47.27 59.83,47.27 v61.55,45.56
PIO1_26/RXD  (via drill 0.3 pad 0.64)
  Top 0.152: v46.69,34.07 46.69,42.89 45.29,44.29 43.13,44.29 42.56,44.86 42.56,46.51 41.74,47.34 40.15,47.34 39.39,48.1 v39.39,50.45
  Bottom 0.152: 42.37,50.32 39.51,50.32 v39.39,50.45 39.39,51.02 Q15.3
  Bottom 0.203: U1.14 50.29,33.92 49.86,33.49 47.26,33.49 v46.69,34.07 | R26.2 42.86,50.81 42.37,50.32 | Q15.3 39.7,50.96
PIO1_27/TXD  (via drill 0.3 pad 0.64)
  Top 0.152: v47.32,34.7 47.01,35.02 47.01,43.02 45.42,44.61 43.26,44.61 42.88,44.99 42.88,46.64 41.86,47.65 40.28,47.65 39.83,48.1 39.83,50 v40.78,50.96
  Bottom 0.152: 41.79,51.34 R26.1 41.74,50.96 v40.78,50.96
  Bottom 0.203: U1.15 49.79,33.99 49.67,33.87 48.15,33.87 v47.32,34.7 | R26.1 41.96,51.43 42.75,52.23 45.93,52.23 Q14.3
PIO1_28/D9  (via drill 0.3 pad 0.64)
  Top 0.152: v52.78,48.1 52.15,47.46 49.17,47.46 v48.47,46.77
  Bottom 0.203: v52.78,48.1 53.33,48.64 53.33,54.47 52.4,55.4 50.43,55.4 J7.2 | U1.31 48.29,44.05 48.59,44.35 48.59,46.64 v48.47,46.77
PIO1_29/SCK0
  Bottom 0.203: J7.6 40.27,55.4 40.28,55.4 40.66,55.78 52.66,55.78 53.71,54.73 53.71,48.07 53.29,47.65 U1.41
PWRKEY  (via drill 0.3 pad 0.64)
  Top 0.305: PWRKEY.0A PWRKEY.0B v64.47,47.78 | U4.1 59.13,50.7 v59.39,50.96
  Bottom 0.305: v64.47,47.78 59.39,47.78 58.56,48.61 Q13.3 58.75,50.32 v59.39,50.96
RESET  (via drill 0.3 pad 0.64)
  Top 0.203: v47.96,23.65 47.96,14.13 46.69,12.86 40.34,12.86 36.53,9.05 RESET.0A 35,9.05
  Top 0.305: J9.3 39.77,2.7 RESET.0B 35,2.95 35,6.63 | 35,9.05 35,7.14 | 35,7.14 35,6.89 | v32.72,6.89 34.75,6.89 | 34.75,6.89 35,6.89 | 34.75,6.89 35,7.14 | 34.75,6.89 35,6.63 | 35,6.63 35,6.89
  Bottom 0.203: R14.1 56.85,26.19 55.58,24.92 48.95,24.92 47.96,23.93 v47.96,23.65
  Bottom 0.305: R13.2 v32.72,6.89 32.72,7.89 C4.1
SIM_CLK
  Top 0.305: U4.32 35.73,31.62 R32.2
SIM_DATA
  Top 0.305: U4.31 35.57,32.62 R48.2
SIM_RST
  Top 0.305: U4.33 36.25,30.62 R47.2
SIM_VDD  (via drill 0.3 pad 0.64)
  Top 0.305: U4.30 36.09,33.62 C44.2 35.37,34.33 C48.2 32.1,35.83 D14.2 31.58,36.35 28.91,36.35 21.92,29.37 v16.59,29.37 | SIM.1 18.01,14.86 20.55,12.32 SIM.5 | 17.86,23.12 SIM.1 | v16.59,23.27 17.71,23.27 SIM.1
  Bottom 0.305: v16.59,29.37 v16.59,23.27 TP10.T
USB_5V
  Bottom 0.203: R1.1 26.13,40.43 26.56,40.86
  Bottom 0.813: TP2.T 22.55,36.99 22.8,37.24 | 22.55,42.96 R29.2 C5.2 22.55,37.62 22.54,37.63 F1.2 22.8,37.24 | 22.55,42.96 R28.2 | 23.96,42.83 D12.2 22.67,42.83 22.55,42.96 | 23.96,42.83 24.72,42.83 | 24.72,42.83 26,42.83 D7.2 26.56,42.27 26.56,40.86 | R8.2 R1.1 | D5.+ 24.71,42.84 24.72,42.83 | R2.2 22.8,37.24 | 23.96,42.83 24.72,43.59
USB_DM  (via drill 0.3 pad 0.64)
  Top 0.152: R23.2 13.4,30.76 14.11,30.76 18.37,26.51 39.13,26.51 43.83,31.21 43.83,39.65 44.15,39.97 v44.15,40.42
  Bottom 0.152: U1.25 46.18,41.05 45.29,40.16 44.4,40.16 v44.15,40.42
USB_DP  (via drill 0.3 pad 0.64)
  Top 0.152: R31.2 13.35,30.45 13.99,30.45 18.24,26.19 39.26,26.19 44.15,31.08 44.15,39.53 45.04,40.42 v45.04,40.8
  Bottom 0.152: U1.26 45.79,41.55 v45.04,40.8
VBAT_900  (via drill 0.3 pad 0.64, 0.38 pad 0.81)
  Top 0.203: STA.+ v72.85,41.18 | 64.85,33.68 68.53,33.68 NET.+ | v64.85,36.1 64.85,33.68 | 64.85,33.68 64.85,33.24 v64.79,33.18
  Bottom 0.203: v72.85,41.18 66.95,41.18 65.23,39.46 62.88,39.46 61.93,38.51 61.93,36.99 62.82,36.1 v64.85,36.1
  Bottom 0.406: v64.79,32.29 64.47,32.29 64.34,32.16 | TP7.T 25.99,24.54 26.11,24.67
  Bottom 2.032: C49.+ C30.+ | C30.+ 63.2,29.12 64.34,30.26 64.34,32.16 | C30.+ 63.2,23.78 61.04,23.78 58.5,21.24 27.51,21.24 26.11,22.64 26.11,24.67 26.11,26.97 Q5.3 | 25.72,27.31 Q5.3 | Q5.3 D16.1
  pour Top (isolate 0.254, no thermals): 62.18,34.95 65.1,34.95 65.1,32.29 62.18,32.29
  pour Bottom (isolate 0.254): 63.2,31.27 63.2,33.56 65.29,33.56 65.29,31.27
VCC_3V3  (via drill 0.3 pad 0.64)
  Top 0.406: v41.23,46.38 41.04,46.57 37.99,46.57 v36.91,45.5 | v51.51,51.15 v55.26,51.15 | v61.29,43.91 v61.29,40.42
  Top 0.61: Q2.2 9.87,22.12 R34.1 8.33,22.11 R24.1 v9.86,20.48 | v15.57,32.29 23.83,32.29 31.07,39.53 v34.94,39.53
  Bottom 0.152: 56.85,49.56 C13.2
  Bottom 0.305: U1.10 52.29,33.44 51.51,32.67 50.01,32.67 C11.2 | U1.58 60.04,40.05 60.4,40.42 v61.29,40.42
  Bottom 0.406: 56.85,49.56 U1.48 58.5,46.7 v61.29,43.91 61.35,43.96 C12.2 | C11.2 47.28,31.89 45.35,33.81 43.5,33.81 42.24,35.07 42.24,36.92 40.15,39.02 40.15,39.84 39.7,40.29 38.26,40.29 L2.2 | U1.33 49.23,47.53 | 49.23,47.53 49.23,47.78 | 49.23,47.78 49.23,48.04 | 49.23,48.04 49.23,49.5 C10.2 50.38,49.57 51.51,50.7 v51.51,51.15 | 48.97,47.78 48.09,47.78 46.35,46.04 41.57,46.04 v41.23,46.38 41.23,48.35 41.96,49.08 R26.8 R26.7 | 48.97,47.78 49.23,47.78 | C13.2 56.72,49.57 56.72,49.69 v55.26,51.15 | 48.97,47.78 49.23,48.04 | 48.97,47.78 49.23,47.53 | C6.2 35.76,39.38 35.89,39.52 | 36.91,39.52 36.73,39.7 36.73,41.5 37.29,42.07 37.29,45.11 v36.91,45.5
  Bottom 0.61: R10.1 76.41,22.25 | 76.41,22.25 74.77,22.25 R45.2 | 76.41,22.25 76.51,22.15 D27.+ 76.51,18.59 76.53,18.57 | 76.15,18.57 R9.2 74.88,18.46 | 76.15,18.57 76.41,18.57 | 76.41,18.57 76.53,18.57 | 76.53,18.57 76.91,18.57 | 76.91,18.57 77.93,18.57 R55.1 | 46.17,8.91 R49.2 R50.2 R51.2 41.6,8.53 40.72,7.65 | 46.17,8.91 C24.2 | R13.1 R12.1 34.24,4.22 35.13,3.33 37.87,3.33 J9.2 40.41,7.2 | 46.17,8.91 46.17,6.56 J9.4 | 39.96,7.65 36.78,7.65 D11.+ 36.78,8.16 34.75,10.19 D20.- 24.73,11.32 22.97,13.08 TF.4 22.97,18.99 23.07,19.08 | 39.96,7.65 40.47,7.65 | 40.47,7.65 40.72,7.65 | 40.41,7.2 40.41,7.59 40.47,7.65 | 40.72,7.65 40.47,7.4 | 40.41,7.2 39.96,7.65 | Q10.2 13.16,32.4 R58.2 13.03,32.54 12.21,33.37 10.43,33.37 9.86,32.8 v9.86,20.48 11.26,19.08 23.07,19.08 | L2.2 36.91,39.52 35.89,39.52 | 35.88,39.51 35.89,39.52 | 14.57,32.41 Q10.2 | 35.89,39.52 v34.95,39.52 v34.94,39.53 34.53,39.53 D8.2 | Q1.2 75.39,15.14 | 76.53,15.14 76.53,15.52 | 76.53,15.52 76.53,18.19 | 76.53,18.19 76.53,18.44 76.41,18.57 | Q1.2 74.5,15.14 69.29,9.94 48.85,9.94 47.84,8.93 C24.2 | C24.2 46.44,8.93 | 76.91,18.57 76.53,18.95 76.15,18.57 | 76.15,18.57 76.53,18.19 | 76.53,18.19 76.91,18.57 | Q1.2 76.15,15.14 | 76.15,15.14 76.53,15.14 | 76.53,15.14 76.91,15.14 | 76.15,15.14 76.53,15.52 | 76.53,15.52 76.91,15.14 | C28.1 23.07,19.08 | v15.57,32.29 14.67,32.29 Q10.2 | 76.91,15.14 78.06,15.14 | 78.06,15.14 TP4.T 78.17,15.03 78.17,15.14 | 78.31,15.02 78.18,15.14 78.17,15.14 | 78.17,15.14 78.06,15.14
VCC_5V  (via drill 0.3 pad 0.64)
  Top 0.61: v17.48,45.5 v27,45.5
  Bottom 0.61: 28.13,45.37 D5.- | 28.19,45.43 D5.- | v27,45.5 28.26,45.5 D5.-
  Bottom 0.813: J9.5 44.22,2.06 25.1,2.06 5.41,21.75 5.41,44.48 6.18,45.24 17.22,45.24 v17.48,45.5
VCC_BAT  (via drill 0.3 pad 0.64)
  Top 1.016: v24.72,35.72 22.3,33.3 7.83,33.3 6.18,34.95 6.18,44.48 7.83,46.13 11.51,46.13 14.93,49.55 23.97,49.55 v24.21,49.31 24.45,49.55 L3.1 31.2,49.55 R20.2
  Bottom 0.203: 23.97,48.91 U2.8 24.95,49.53 24.97,49.55 | U2.5 24.28,47.41 v24.21,47.34
  Bottom 0.305: v24.21,49.31 24.59,48.92 24.97,48.92
  Bottom 0.61: Q6.3 | v24.71,35.71 v24.72,35.72
  Bottom 0.813: Q6.3 v24.71,35.71
  Bottom 1.016: C26.+ 24.46,51.59 24.46,51.72 22.19,53.99 BAT.1
  pour Bottom (isolate 0.254, no thermals): 23.83,52.86 25.35,52.86 25.35,48.92 23.83,48.92
  pour Top (isolate 0.254, no thermals): 23.32,47.02 24.46,47.02 24.46,50.07 23.32,50.07
VCC_BUCK  (via drill 0.3 pad 0.64)
  Top 0.813: v34.62,46.13 D9.-
  Bottom 0.406: 33.72,23.65 TP3.T
  Bottom 0.61: 33.78,26.18 C7.+ | 33.72,26.11 C7.+ | 33.59,25.99 C7.+
  Bottom 0.813: C27.2 TP3.T 33.73,23.79 33.73,26.06 33.8,26.13 C7.+ 33.8,29.24 | v34.62,46.13 36.26,44.49 Q3.3 36.26,42.18 35.32,41.24 33.16,41.24 32.46,40.54 32.46,34.07 30.88,32.48 30.45,32.48 | U5.1 35.13,30.58 33.97,29.41 | 33.97,29.41 33.8,29.24 | 33.8,29.24 33.33,28.77 | U5.4 33.33,28.77 | 33.33,28.77 33.33,28.82 32.74,29.41 | 32.74,29.41 30.37,31.78 30.37,32.56 30.45,32.48 | 33.97,29.41 32.74,29.41 | R43.2 29.21,30.51 D6.2 30.45,32.48
VCC_G
  Bottom 0.406: 71.69,15.02 71.71,15.03
  Bottom 0.61: 61.53,15.02 UART.3 | 69.66,15.02 I2C.3 | I2C.3 71.71,15.03 71.96,15.03 Q1.3 | I2C.3 65.52,15.03 C20.2 61.56,15.02 UART.3 | UART.3 57.26,15.03 C25.2 53.3,15.02 ADC.3 50.28,15.03 C19.2 TP6.T
VCC_SOLAR
  Bottom 0.305: 16.45,51.25 16.45,50.45 C23.2
  Bottom 1.016: SOLAR.1 15.84,51.85 D24.2 16.45,51.25 Q9.3
VDD_EXT  (via drill 0.3 pad 0.64)
  Top 0.203: U4.15 45.13,48.51 v44.85,48.23 | v43.45,48.04 40.78,48.04 v40.47,48.35
  Bottom 0.203: v44.85,48.23 47.39,48.23 47.7,48.54 Q14.1 | R26.6 43.66,48.25 43.64,48.23 | R26.5 44.56,48.51 v44.85,48.23 | v43.45,48.04 43.64,48.23 | 40.34,49.05 Q15.1 40.47,49.18 v40.47,48.35 37.98,48.35 37.48,48.85 C29.1 | 43.64,48.23 v44.85,48.23
VRTC
  Top 0.61: U4.26 C51.2
XTALIN
  Bottom 0.203: U1.8 53.29,32.41 C2.2 R5.2 53.8,29.11 X1.2
XTALOUT
  Bottom 0.203: U1.9 52.79,32.41 C3.2 R5.1 52.28,29.11 X1.1

## Text on the board
tPlace: P1_29 | P1_28 | P1_25 | P1_24 | P1_18 | P1_17 | P0_17 | P0_19 | P0_18 | P0_4 | P0_5 | P0_7 | GND | P0_8 | P0_9 | P0_2 | P1_4 | P1_5 | RX | TX | MIC0+ | MIC0- | SPK+ | SPK- | MISO | NC | SCK | MOSI | RST | GND | VCC | SWDIO | SWCLK | A1 | RX | SCL | GND | A0 | TX | SDA | 3V3 | 3V3 | 3V3 | GND | GND | GND | + | P0_12 | P1_14 | P0_4 | P0_11 | P1_13 | P0_5 | GSM | 3V3 | 3V3 | 5V | GND | GND | NC | P1_16 | RESET | P0_11 | P0_12 | P0_13 | P0_14 | P0_16 | P0_22
bPlace: + | Arch GPRS | v2.0 06/18/2014 | by seeed studio | www.seeedstudio.com | + | + | + | +